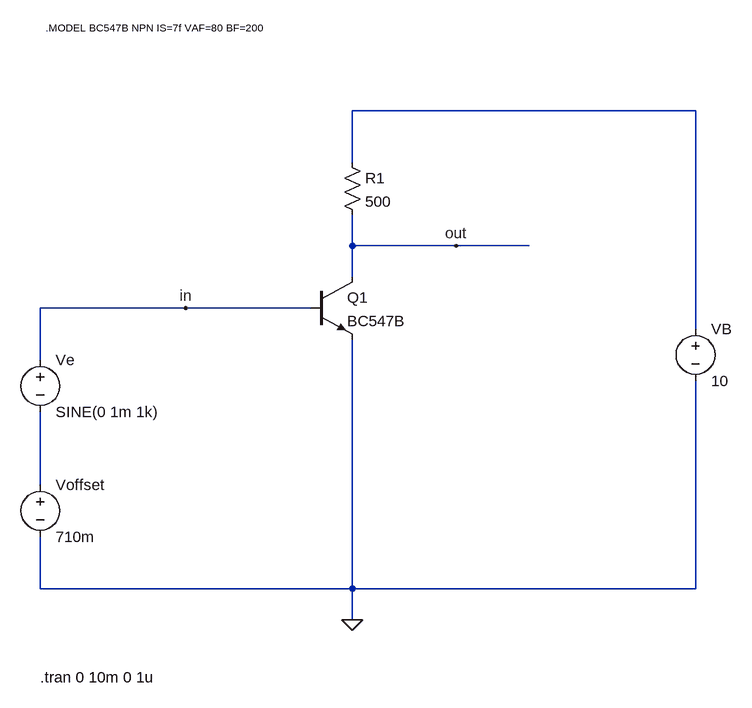
[diagram p0: schematic schaltung.asc]
schaltung.asc, the LTspice schematic file:
Version 4
SHEET 1 880 788
WIRE 752 -128 224 -128
WIRE 224 -48 224 -128
WIRE 224 80 224 32
WIRE 384 80 224 80
WIRE 496 80 384 80
WIRE 224 128 224 80
WIRE -32 176 -256 176
WIRE 160 176 -32 176
WIRE 752 208 752 -128
WIRE -256 256 -256 176
WIRE -256 448 -256 336
WIRE -256 608 -256 528
WIRE 224 608 224 224
WIRE 224 608 -256 608
WIRE 752 608 752 288
WIRE 752 608 224 608
WIRE 224 656 224 608
FLAG 224 656 0
FLAG -32 176 in
FLAG 384 80 out
SYMBOL npn 160 128 R0
SYMATTR InstName Q1
SYMATTR Value BC547B
SYMBOL res 208 -64 R0
SYMATTR InstName R1
SYMATTR Value 500
SYMBOL voltage -256 432 R0
WINDOW 123 0 0 Left 0
WINDOW 39 0 0 Left 0
SYMATTR InstName Voffset
SYMATTR Value 710m
SYMBOL voltage -256 240 R0
WINDOW 123 0 0 Left 0
WINDOW 39 0 0 Left 0
SYMATTR InstName Ve
SYMATTR Value SINE(0 1m 1k)
SYMBOL voltage 752 192 R0
WINDOW 123 0 0 Left 0
WINDOW 39 0 0 Left 0
SYMATTR InstName VB
SYMATTR Value 10
TEXT -248 -256 Left 1 !.MODEL BC547B NPN IS=7f VAF=80 BF=200
TEXT -256 744 Left 2 !.tran 0 10m 0 1u

The netlist it stands for:
* schaltung.asc
Q1 out in 0 0 BC547B
R1 N001 out 500
Voffset N002 0 710m
Ve in N002 SINE(0 1m 1k)
VB N001 0 10
.model NPN NPN
.model PNP PNP
.lib standard.bjt
.MODEL BC547B NPN IS=7f VAF=80 BF=200
.tran 0 10m 0 1u
.backanno
.end